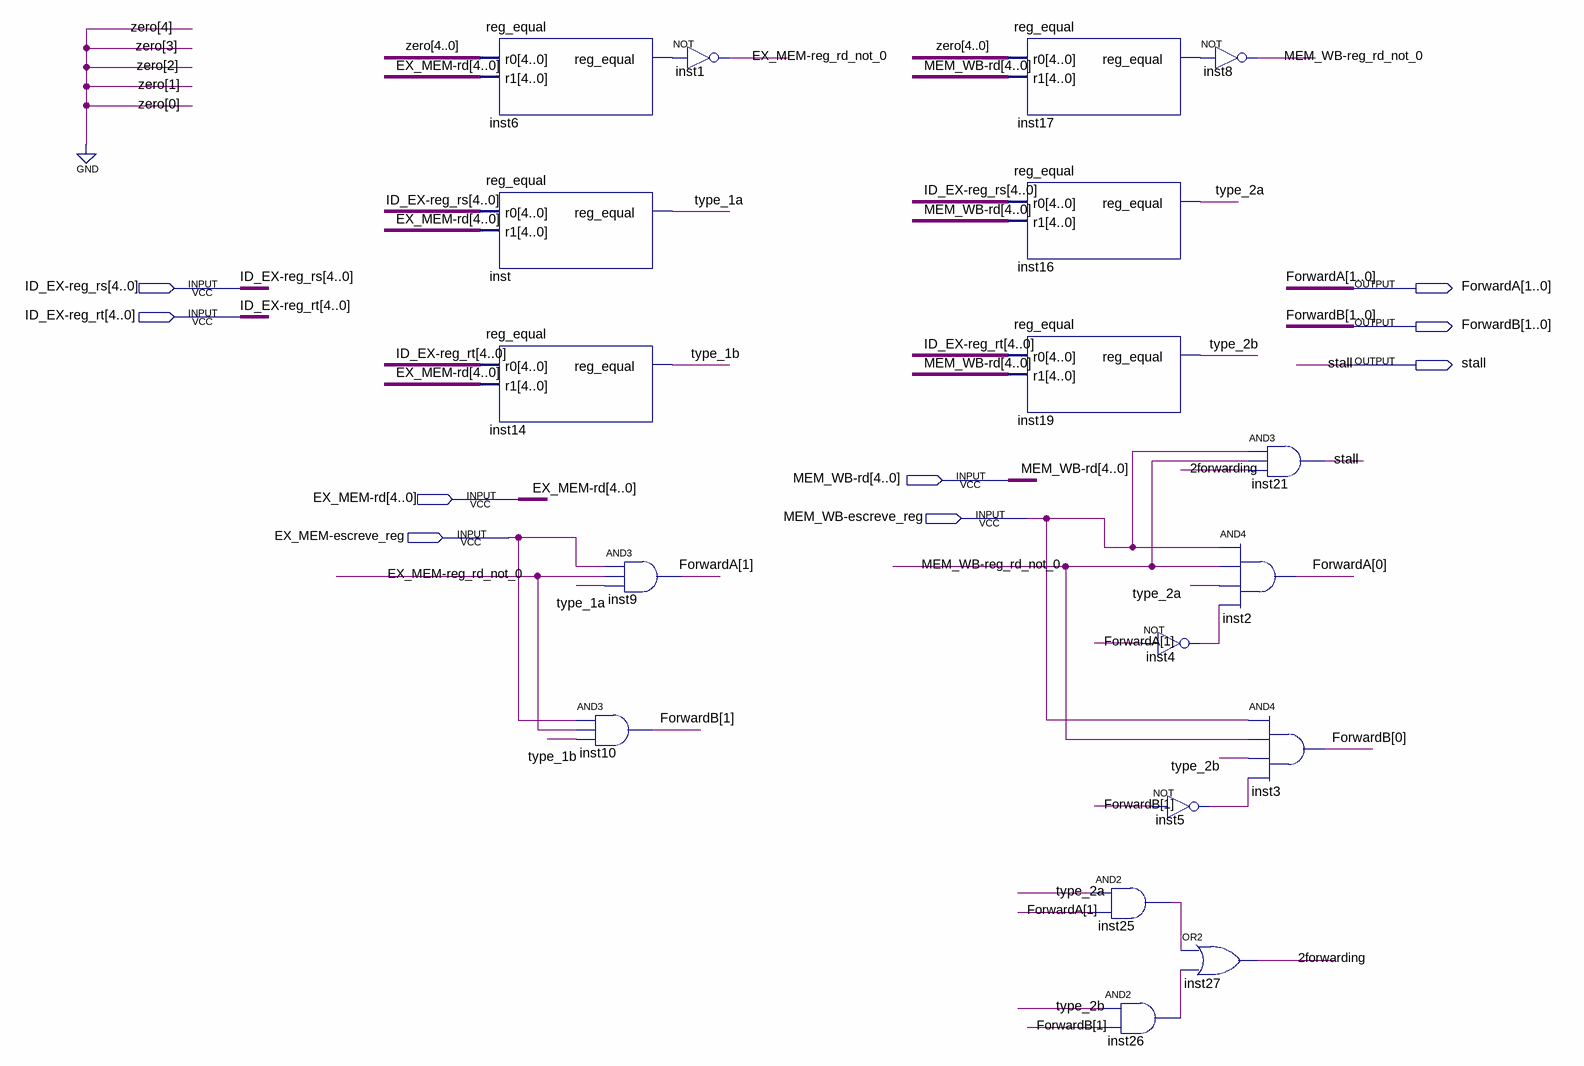
[diagram p0: schematic sheet]
// Quartus schematic forwarding.bdf as structural Verilog: 18 symbols, 9 pins
module forwarding (
  input  [4:0] \ID_EX-reg_rs ,
  input  [4:0] \ID_EX-reg_rt ,
  input  [4:0] \MEM_WB-rd ,
  input  [4:0] \EX_MEM-rd ,
  input  \MEM_WB-escreve_reg ,
  input  \EX_MEM-escreve_reg ,
  output [1:0] ForwardA,
  output [1:0] ForwardB,
  output stall
);

  wire \2forwarding , \EX_MEM-reg_rd_not_0 , inst4_out, inst5_out, inst6_reg_equal, inst17_reg_equal,
       inst25_out, inst26_out, \MEM_WB-reg_rd_not_0 , type_1a, type_1b, type_2a, type_2b;

  reg_equal inst6 (.r0({5{1'b0}}), .r1(\EX_MEM-rd ), .reg_equal(inst6_reg_equal));
  reg_equal inst (.r0(\ID_EX-reg_rs ), .r1(\EX_MEM-rd ), .reg_equal(type_1a));
  reg_equal inst14 (.r0(\ID_EX-reg_rt ), .r1(\EX_MEM-rd ), .reg_equal(type_1b));
  and inst9 (ForwardA[1], \EX_MEM-escreve_reg , \EX_MEM-reg_rd_not_0 , type_1a);
  and inst10 (ForwardB[1], \EX_MEM-escreve_reg , \EX_MEM-reg_rd_not_0 , type_1b);
  not inst1 (\EX_MEM-reg_rd_not_0 , inst6_reg_equal);
  reg_equal inst17 (.r0({5{1'b0}}), .r1(\MEM_WB-rd ), .reg_equal(inst17_reg_equal));
  reg_equal inst16 (.r0(\ID_EX-reg_rs ), .r1(\MEM_WB-rd ), .reg_equal(type_2a));
  reg_equal inst19 (.r0(\ID_EX-reg_rt ), .r1(\MEM_WB-rd ), .reg_equal(type_2b));
  not inst4 (inst4_out, ForwardA[1]);
  not inst5 (inst5_out, ForwardB[1]);
  and inst25 (inst25_out, type_2a, ForwardA[1]);
  and inst26 (inst26_out, type_2b, ForwardB[1]);
  not inst8 (\MEM_WB-reg_rd_not_0 , inst17_reg_equal);
  and inst2 (ForwardA[0], \MEM_WB-escreve_reg , \MEM_WB-reg_rd_not_0 , type_2a, inst4_out);
  or inst27 (\2forwarding , inst25_out, inst26_out);
  and inst21 (stall, \MEM_WB-escreve_reg , \MEM_WB-reg_rd_not_0 , \2forwarding );
  and inst3 (ForwardB[0], \MEM_WB-escreve_reg , \MEM_WB-reg_rd_not_0 , type_2b, inst5_out);
endmodule
